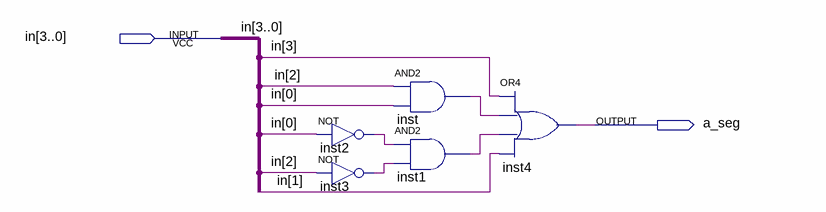
[diagram p0: schematic sheet]
// Quartus schematic a_seg.bdf as structural Verilog: 5 symbols, 2 pins
module a_seg (
  input  [3:0] in,
  output a_seg
);

  wire inst1_out, inst2_out, inst3_out, inst_out;

  not inst2 (inst2_out, in[0]);
  not inst3 (inst3_out, in[2]);
  and inst (inst_out, in[2], in[0]);
  and inst1 (inst1_out, inst2_out, inst3_out);
  or inst4 (a_seg, in[3], inst_out, inst1_out, in[1]);
endmodule
